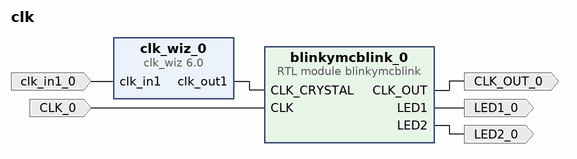
[diagram p0: block diagram of the top level]
# Vivado block design clk, xc7a35tcpg236-1, Vivado 2024.1
create_bd_design clk

create_bd_port -dir O CLK_OUT_0
create_bd_port -dir O LED2_0
create_bd_port -dir O LED1_0
create_bd_port -dir I -type clk CLK_0
create_bd_port -dir I -type clk clk_in1_0
set_property -dict {CONFIG.FREQ_HZ 12000000} [get_bd_ports clk_in1_0]

create_bd_cell -type ip -vlnv xilinx.com:ip:clk_wiz:6.0 clk_wiz_0
set_property -dict [list \
  CONFIG.CLKOUT1_DRIVES BUFG \
  CONFIG.CLKOUT1_JITTER 765.157 \
  CONFIG.CLKOUT1_PHASE_ERROR 668.310 \
  CONFIG.CLKOUT1_REQUESTED_OUT_FREQ 6 \
  CONFIG.CLKOUT2_DRIVES BUFG \
  CONFIG.CLKOUT3_DRIVES BUFG \
  CONFIG.CLKOUT4_DRIVES BUFG \
  CONFIG.CLKOUT5_DRIVES BUFG \
  CONFIG.CLKOUT6_DRIVES BUFG \
  CONFIG.CLKOUT7_DRIVES BUFG \
  CONFIG.FEEDBACK_SOURCE FDBK_AUTO \
  CONFIG.JITTER_SEL Min_O_Jitter \
  CONFIG.MMCM_BANDWIDTH HIGH \
  CONFIG.MMCM_CLKFBOUT_MULT_F 62.500 \
  CONFIG.MMCM_CLKIN1_PERIOD 83.333 \
  CONFIG.MMCM_CLKIN2_PERIOD 10.0 \
  CONFIG.MMCM_CLKOUT0_DIVIDE_F 125.000 \
  CONFIG.MMCM_COMPENSATION ZHOLD \
  CONFIG.PRIMITIVE MMCM \
  CONFIG.PRIM_IN_FREQ 12.000 \
] [get_bd_cells clk_wiz_0]
create_bd_cell -type module -reference blinkymcblink blinkymcblink_0

# ---- connections ----

connect_bd_net -net CLK_0_1 [get_bd_ports CLK_0] [get_bd_pins blinkymcblink_0/CLK]
connect_bd_net [get_bd_pins blinkymcblink_0/CLK_OUT] [get_bd_ports CLK_OUT_0]
connect_bd_net [get_bd_pins blinkymcblink_0/LED1] [get_bd_ports LED1_0]
connect_bd_net [get_bd_pins blinkymcblink_0/LED2] [get_bd_ports LED2_0]
connect_bd_net -net clk_in1_0_1 [get_bd_ports clk_in1_0] [get_bd_pins clk_wiz_0/clk_in1]
connect_bd_net [get_bd_pins clk_wiz_0/clk_out1] [get_bd_pins blinkymcblink_0/CLK_CRYSTAL]

validate_bd_design
save_bd_design
